# Altium project Shuttler_AMC.PrjPcb (part 16 of 20)

## Sheet FPGA_Banks_44_45_46_DDR64.SchDoc: =ProjectName
size 420 x 297 mm; Author: T.P.; CompanyName: WUT; DrawnBy: T.P.; Organization: WUT ISE; Address1: Warsaw Univeristy of Technology; Address2: Nowowiejska 15/19; DocumentNumber: 5; Revision: 0.9; SheetNumber: 5; SheetTotal: 36; EDA_Number: ARTIQ; Projet: ARTIQ/SINARA; ModifiedBy: -; CreateDate: XX/XX/XXXX; CheckedDate: -; Title2: FPGA_Banks_44_45_46_DDR64.SchDoc; DivGrp: ISE; Designer: G.K. and T.P.; ModifiedDate: -; ProjectName: ADC/DAC MEZZANINE
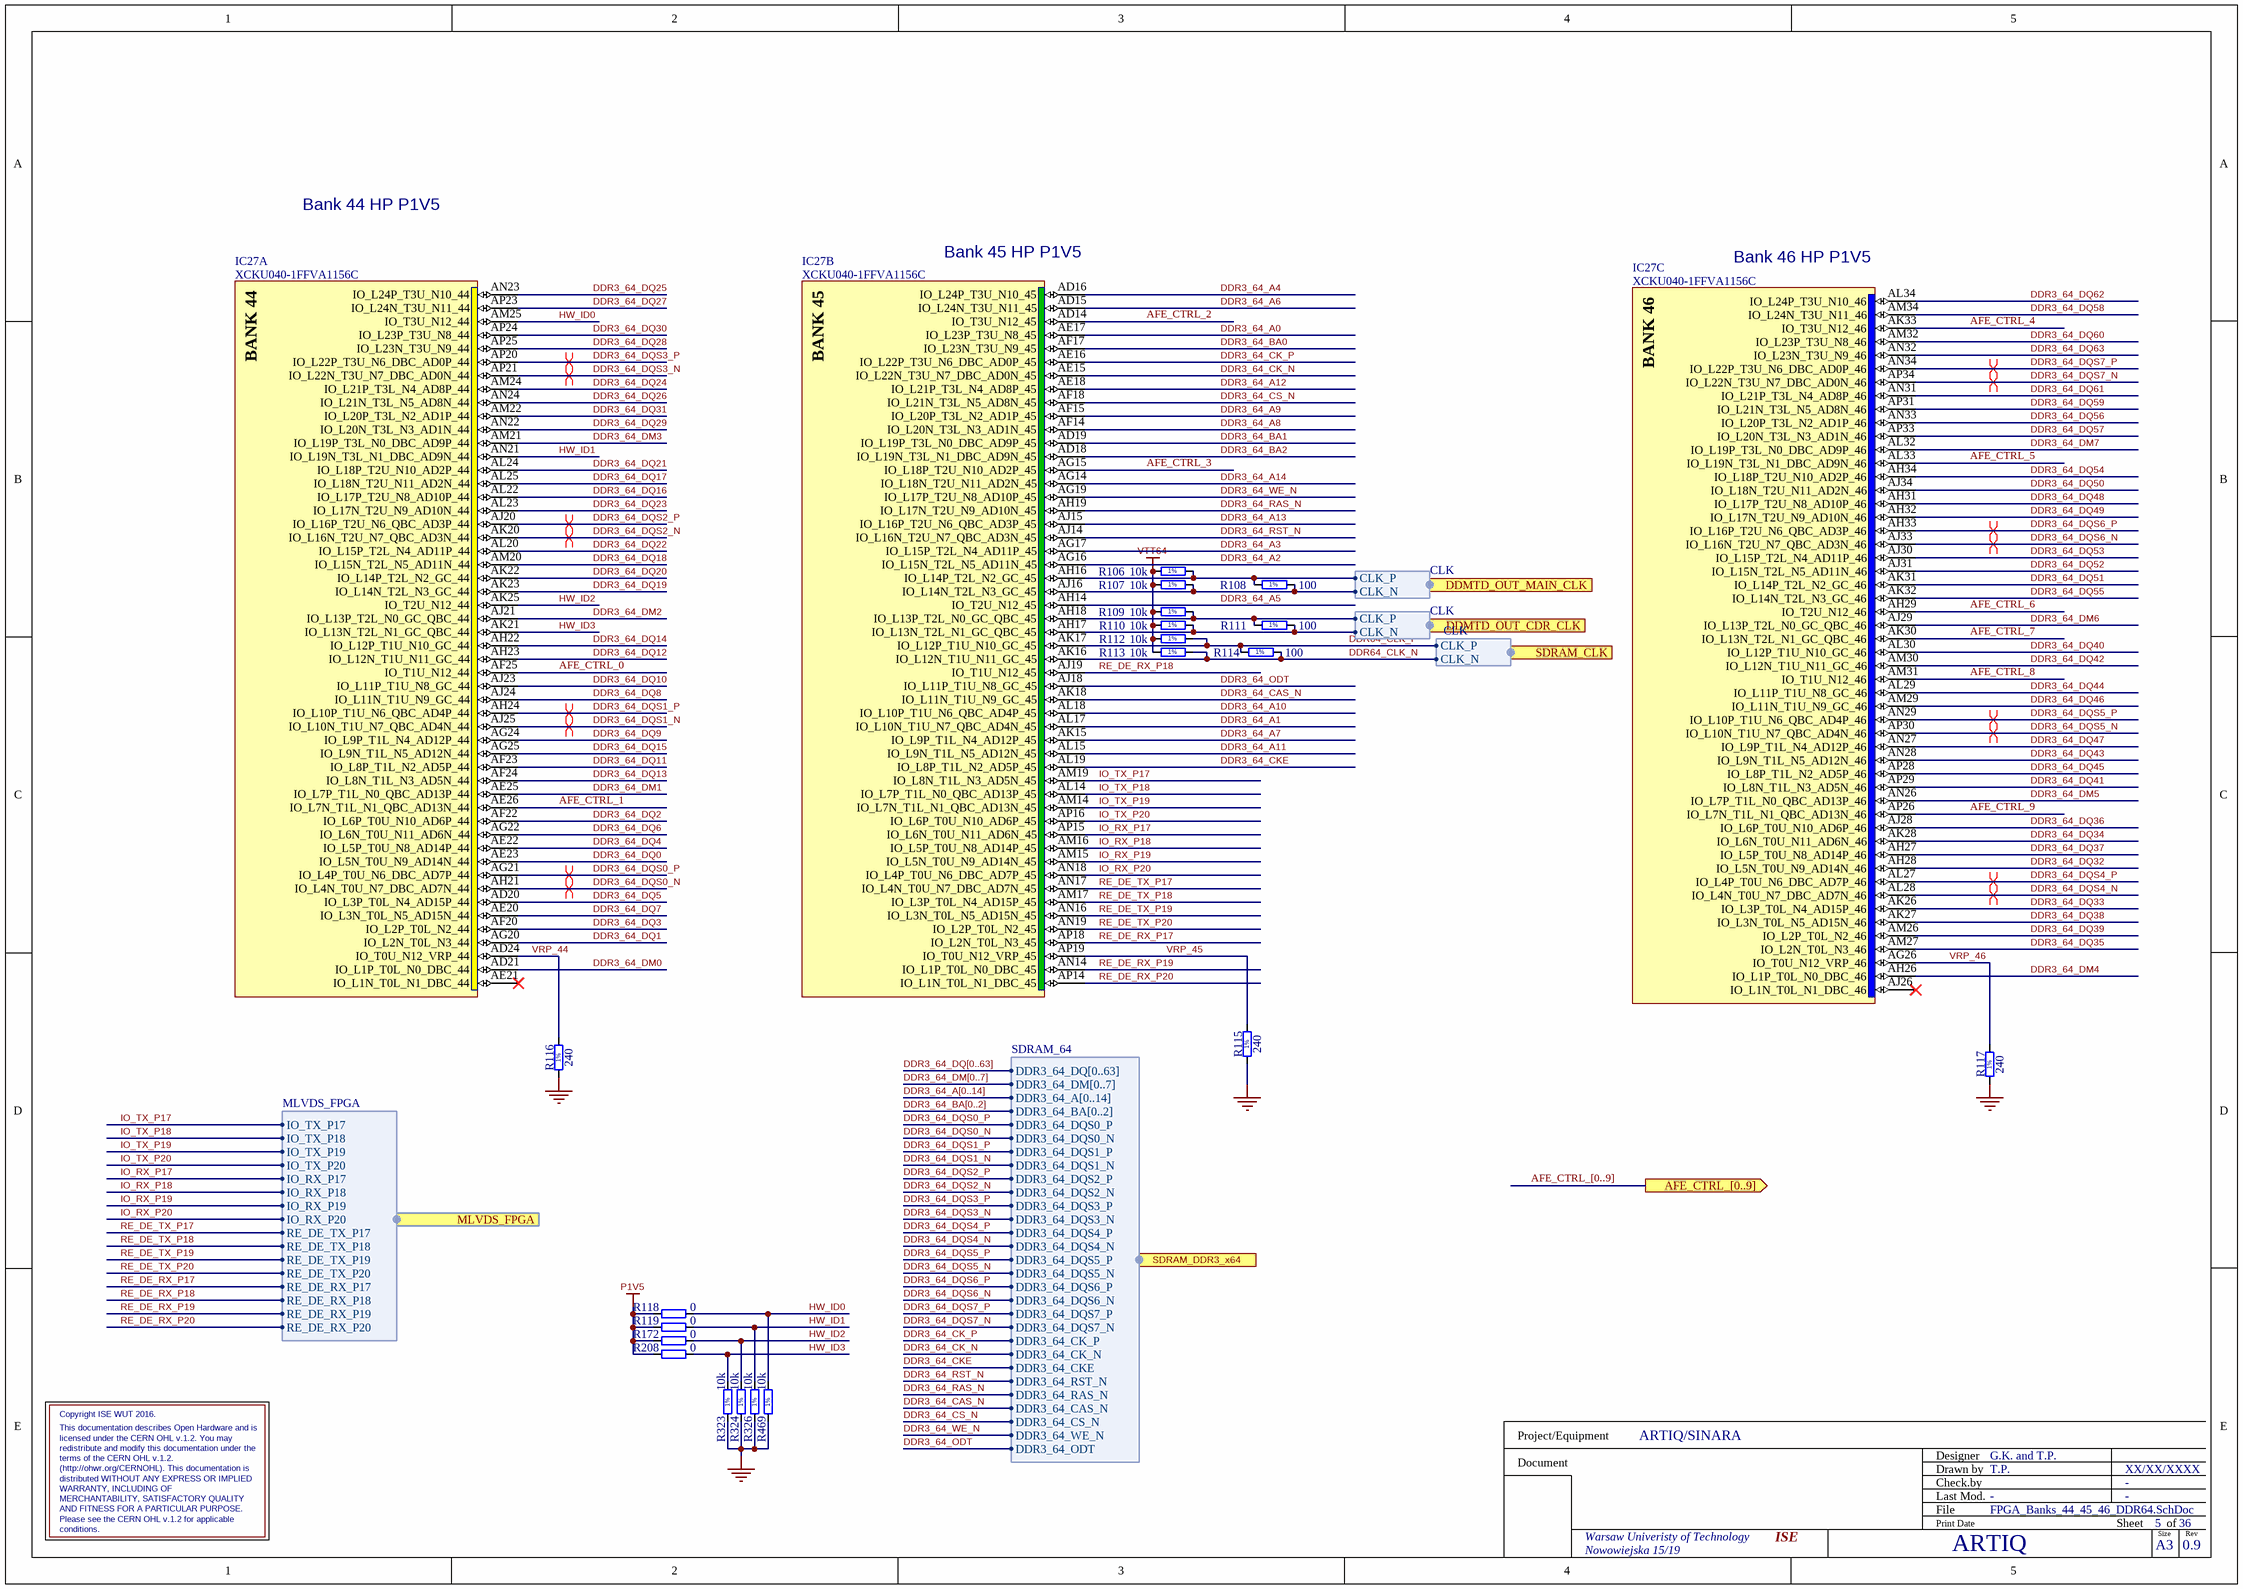
[diagram p29: FPGA_Banks_44_45_46_DDR64.SchDoc]

### Parts
IC27  XCKU040-1FFVA1156C  [BGA1156C100P34X34_3500X3500X350]  (parts A,B,C of 22)
R106  10k  [RESC1005X40N]
R107  10k  [RESC1005X40N]
R108  100  [RESC0603X28N]
R109  10k  [RESC1005X40N]
R110  10k  [RESC1005X40N]
R111  100  [RESC0603X28N]
R112  10k  [RESC1005X40N]
R113  10k  [RESC1005X40N]
R114  100  [RESC0603X28N]
R115  240  [RESC1005X40N]
R116  240  [RESC1005X40N]
R117  240  [RESC1005X40N]
R118  0  [RESC1005X40N]
R119  0  [RESC1005X40N]
R172  0  [RESC1005X40N]
R208  0  [RESC1005X40N]
R323  10k  [RESC1005X40N]
R324  10k  [RESC1005X40N]
R326  10k  [RESC1005X40N]
R469  10k  [RESC1005X40N]

### Ports
AFE_CTRL_[0..9] (out), DDMTD_OUT_CDR_CLK (harness CLK), DDMTD_OUT_MAIN_CLK (harness CLK), MLVDS_FPGA (harness MLVDS_FPGA), SDRAM_CLK (harness CLK), SDRAM_DDR3_x64 (harness SDRAM_64)

### Harnesses
SDRAM_64: DDR3_64_DQ[0..63], DDR3_64_DM[0..7], DDR3_64_A[0..14], DDR3_64_BA[0..2], DDR3_64_DQS1_P, DDR3_64_DQS0_N, DDR3_64_DQS0_P, DDR3_64_DQS5_P, DDR3_64_DQS5_N, DDR3_64_DQS6_P, DDR3_64_DQS6_N, DDR3_64_DQS7_P, DDR3_64_DQS7_N, DDR3_64_CK_P, DDR3_64_CK_N, DDR3_64_CKE, DDR3_64_RST_N, DDR3_64_RAS_N, DDR3_64_CAS_N, DDR3_64_WE_N, DDR3_64_CS_N, DDR3_64_DQS2_N, DDR3_64_DQS2_P, DDR3_64_DQS1_N, DDR3_64_DQS3_P, DDR3_64_ODT, DDR3_64_DQS4_P, DDR3_64_DQS3_N, DDR3_64_DQS4_N
MLVDS_FPGA: IO_TX_P17, IO_TX_P18, IO_TX_P19, IO_TX_P20, IO_RX_P17, IO_RX_P18, IO_RX_P19, IO_RX_P20, RE_DE_TX_P17, RE_DE_TX_P18, RE_DE_TX_P19, RE_DE_TX_P20, RE_DE_RX_P17, RE_DE_RX_P18, RE_DE_RX_P19, RE_DE_RX_P20
CLK: CLK_N, CLK_P

### Nets
GND: R115.1 R116.1 R117.1 R323.1 R324.1 R326.1 R469.1
P1V5: R118.1 R119.1 R172.1 R208.1
VTT64: R106.1 R107.1 R109.1 R110.1 R112.1 R113.1
AFE_CTRL_0: IC27.AF25(IO_T1U_N12_44)
AFE_CTRL_1: IC27.AE26(IO_L7N_T1L_N1_QBC_AD13N_44)
AFE_CTRL_2: IC27.AD14(IO_T3U_N12_45)
AFE_CTRL_3: IC27.AG15(IO_L18P_T2U_N10_AD2P_45)
AFE_CTRL_4: IC27.AK33(IO_T3U_N12_46)
AFE_CTRL_5: IC27.AL33(IO_L19N_T3L_N1_DBC_AD9N_46)
AFE_CTRL_6: IC27.AH29(IO_T2U_N12_46)
AFE_CTRL_7: IC27.AK30(IO_L13N_T2L_N1_GC_QBC_46)
AFE_CTRL_8: IC27.AM31(IO_T1U_N12_46)
AFE_CTRL_9: IC27.AP26(IO_L7N_T1L_N1_QBC_AD13N_46)
DDR3_64_A0: IC27.AE17(IO_L23P_T3U_N8_45)
DDR3_64_A1: IC27.AL17(IO_L10N_T1U_N7_QBC_AD4N_45)
DDR3_64_A2: IC27.AG16(IO_L15N_T2L_N5_AD11N_45)
DDR3_64_A3: IC27.AG17(IO_L15P_T2L_N4_AD11P_45)
DDR3_64_A4: IC27.AD16(IO_L24P_T3U_N10_45)
DDR3_64_A5: IC27.AH14(IO_T2U_N12_45)
DDR3_64_A6: IC27.AD15(IO_L24N_T3U_N11_45)
DDR3_64_A7: IC27.AK15(IO_L9P_T1L_N4_AD12P_45)
DDR3_64_A8: IC27.AF14(IO_L20N_T3L_N3_AD1N_45)
DDR3_64_A9: IC27.AF15(IO_L20P_T3L_N2_AD1P_45)
DDR3_64_A10: IC27.AL18(IO_L10P_T1U_N6_QBC_AD4P_45)
DDR3_64_A11: IC27.AL15(IO_L9N_T1L_N5_AD12N_45)
DDR3_64_A12: IC27.AE18(IO_L21P_T3L_N4_AD8P_45)
DDR3_64_A13: IC27.AJ15(IO_L16P_T2U_N6_QBC_AD3P_45)
DDR3_64_A14: IC27.AG14(IO_L18N_T2U_N11_AD2N_45)
DDR3_64_BA0: IC27.AF17(IO_L23N_T3U_N9_45)
DDR3_64_BA1: IC27.AD19(IO_L19P_T3L_N0_DBC_AD9P_45)
DDR3_64_BA2: IC27.AD18(IO_L19N_T3L_N1_DBC_AD9N_45)
DDR3_64_CAS_N: IC27.AK18(IO_L11N_T1U_N9_GC_45) ; port SDRAM_DDR3_x64.DDR3_64_CAS_N  [project net SDRAM_DDR3_x64.DDR3_64_CAS_N]
DDR3_64_CK_N: IC27.AE15(IO_L22N_T3U_N7_DBC_AD0N_45) ; port SDRAM_DDR3_x64.DDR3_64_CK_N  [project net SDRAM_DDR3_x64.DDR3_64_CK_N]
DDR3_64_CK_P: IC27.AE16(IO_L22P_T3U_N6_DBC_AD0P_45) ; port SDRAM_DDR3_x64.DDR3_64_CK_P  [project net SDRAM_DDR3_x64.DDR3_64_CK_P]
DDR3_64_CKE: IC27.AL19(IO_L8P_T1L_N2_AD5P_45) ; port SDRAM_DDR3_x64.DDR3_64_CKE  [project net SDRAM_DDR3_x64.DDR3_64_CKE]
DDR3_64_CS_N: IC27.AF18(IO_L21N_T3L_N5_AD8N_45) ; port SDRAM_DDR3_x64.DDR3_64_CS_N  [project net SDRAM_DDR3_x64.DDR3_64_CS_N]
DDR3_64_DM0: IC27.AD21(IO_L1P_T0L_N0_DBC_44)
DDR3_64_DM1: IC27.AE25(IO_L7P_T1L_N0_QBC_AD13P_44)
DDR3_64_DM2: IC27.AJ21(IO_L13P_T2L_N0_GC_QBC_44)
DDR3_64_DM3: IC27.AM21(IO_L19P_T3L_N0_DBC_AD9P_44)
DDR3_64_DM4: IC27.AH26(IO_L1P_T0L_N0_DBC_46)
DDR3_64_DM5: IC27.AN26(IO_L7P_T1L_N0_QBC_AD13P_46)
DDR3_64_DM6: IC27.AJ29(IO_L13P_T2L_N0_GC_QBC_46)
DDR3_64_DM7: IC27.AL32(IO_L19P_T3L_N0_DBC_AD9P_46)
DDR3_64_DQ0: IC27.AE23(IO_L5N_T0U_N9_AD14N_44)
DDR3_64_DQ1: IC27.AG20(IO_L2N_T0L_N3_44)
DDR3_64_DQ2: IC27.AF22(IO_L6P_T0U_N10_AD6P_44)
DDR3_64_DQ3: IC27.AF20(IO_L2P_T0L_N2_44)
DDR3_64_DQ4: IC27.AE22(IO_L5P_T0U_N8_AD14P_44)
DDR3_64_DQ5: IC27.AD20(IO_L3P_T0L_N4_AD15P_44)
DDR3_64_DQ6: IC27.AG22(IO_L6N_T0U_N11_AD6N_44)
DDR3_64_DQ7: IC27.AE20(IO_L3N_T0L_N5_AD15N_44)
DDR3_64_DQ8: IC27.AJ24(IO_L11N_T1U_N9_GC_44)
DDR3_64_DQ9: IC27.AG24(IO_L9P_T1L_N4_AD12P_44)
DDR3_64_DQ10: IC27.AJ23(IO_L11P_T1U_N8_GC_44)
DDR3_64_DQ11: IC27.AF23(IO_L8P_T1L_N2_AD5P_44)
DDR3_64_DQ12: IC27.AH23(IO_L12N_T1U_N11_GC_44)
DDR3_64_DQ13: IC27.AF24(IO_L8N_T1L_N3_AD5N_44)
DDR3_64_DQ14: IC27.AH22(IO_L12P_T1U_N10_GC_44)
DDR3_64_DQ15: IC27.AG25(IO_L9N_T1L_N5_AD12N_44)
DDR3_64_DQ16: IC27.AL22(IO_L17P_T2U_N8_AD10P_44)
DDR3_64_DQ17: IC27.AL25(IO_L18N_T2U_N11_AD2N_44)
DDR3_64_DQ18: IC27.AM20(IO_L15N_T2L_N5_AD11N_44)
DDR3_64_DQ19: IC27.AK23(IO_L14N_T2L_N3_GC_44)
DDR3_64_DQ20: IC27.AK22(IO_L14P_T2L_N2_GC_44)
DDR3_64_DQ21: IC27.AL24(IO_L18P_T2U_N10_AD2P_44)
DDR3_64_DQ22: IC27.AL20(IO_L15P_T2L_N4_AD11P_44)
DDR3_64_DQ23: IC27.AL23(IO_L17N_T2U_N9_AD10N_44)
DDR3_64_DQ24: IC27.AM24(IO_L21P_T3L_N4_AD8P_44)
DDR3_64_DQ25: IC27.AN23(IO_L24P_T3U_N10_44)
DDR3_64_DQ26: IC27.AN24(IO_L21N_T3L_N5_AD8N_44)
DDR3_64_DQ27: IC27.AP23(IO_L24N_T3U_N11_44)
DDR3_64_DQ28: IC27.AP25(IO_L23N_T3U_N9_44)
DDR3_64_DQ29: IC27.AN22(IO_L20N_T3L_N3_AD1N_44)
DDR3_64_DQ30: IC27.AP24(IO_L23P_T3U_N8_44)
DDR3_64_DQ31: IC27.AM22(IO_L20P_T3L_N2_AD1P_44)
DDR3_64_DQ32: IC27.AH28(IO_L5N_T0U_N9_AD14N_46)
DDR3_64_DQ33: IC27.AK26(IO_L3P_T0L_N4_AD15P_46)
DDR3_64_DQ34: IC27.AK28(IO_L6N_T0U_N11_AD6N_46)
DDR3_64_DQ35: IC27.AM27(IO_L2N_T0L_N3_46)
DDR3_64_DQ36: IC27.AJ28(IO_L6P_T0U_N10_AD6P_46)
DDR3_64_DQ37: IC27.AH27(IO_L5P_T0U_N8_AD14P_46)
DDR3_64_DQ38: IC27.AK27(IO_L3N_T0L_N5_AD15N_46)
DDR3_64_DQ39: IC27.AM26(IO_L2P_T0L_N2_46)
DDR3_64_DQ40: IC27.AL30(IO_L12P_T1U_N10_GC_46)
DDR3_64_DQ41: IC27.AP29(IO_L8N_T1L_N3_AD5N_46)
DDR3_64_DQ42: IC27.AM30(IO_L12N_T1U_N11_GC_46)
DDR3_64_DQ43: IC27.AN28(IO_L9N_T1L_N5_AD12N_46)
DDR3_64_DQ44: IC27.AL29(IO_L11P_T1U_N8_GC_46)
DDR3_64_DQ45: IC27.AP28(IO_L8P_T1L_N2_AD5P_46)
DDR3_64_DQ46: IC27.AM29(IO_L11N_T1U_N9_GC_46)
DDR3_64_DQ47: IC27.AN27(IO_L9P_T1L_N4_AD12P_46)
DDR3_64_DQ48: IC27.AH31(IO_L17P_T2U_N8_AD10P_46)
DDR3_64_DQ49: IC27.AH32(IO_L17N_T2U_N9_AD10N_46)
DDR3_64_DQ50: IC27.AJ34(IO_L18N_T2U_N11_AD2N_46)
DDR3_64_DQ51: IC27.AK31(IO_L14P_T2L_N2_GC_46)
DDR3_64_DQ52: IC27.AJ31(IO_L15N_T2L_N5_AD11N_46)
DDR3_64_DQ53: IC27.AJ30(IO_L15P_T2L_N4_AD11P_46)
DDR3_64_DQ54: IC27.AH34(IO_L18P_T2U_N10_AD2P_46)
DDR3_64_DQ55: IC27.AK32(IO_L14N_T2L_N3_GC_46)
DDR3_64_DQ56: IC27.AN33(IO_L20P_T3L_N2_AD1P_46)
DDR3_64_DQ57: IC27.AP33(IO_L20N_T3L_N3_AD1N_46)
DDR3_64_DQ58: IC27.AM34(IO_L24N_T3U_N11_46)
DDR3_64_DQ59: IC27.AP31(IO_L21N_T3L_N5_AD8N_46)
DDR3_64_DQ60: IC27.AM32(IO_L23P_T3U_N8_46)
DDR3_64_DQ61: IC27.AN31(IO_L21P_T3L_N4_AD8P_46)
DDR3_64_DQ62: IC27.AL34(IO_L24P_T3U_N10_46)
DDR3_64_DQ63: IC27.AN32(IO_L23N_T3U_N9_46)
DDR3_64_DQS0_N: IC27.AH21(IO_L4N_T0U_N7_DBC_AD7N_44) ; port SDRAM_DDR3_x64.DDR3_64_DQS0_N  [project net SDRAM_DDR3_x64.DDR3_64_DQS0_N]
DDR3_64_DQS0_P: IC27.AG21(IO_L4P_T0U_N6_DBC_AD7P_44) ; port SDRAM_DDR3_x64.DDR3_64_DQS0_P  [project net SDRAM_DDR3_x64.DDR3_64_DQS0_P]
DDR3_64_DQS1_N: IC27.AJ25(IO_L10N_T1U_N7_QBC_AD4N_44) ; port SDRAM_DDR3_x64.DDR3_64_DQS1_N  [project net SDRAM_DDR3_x64.DDR3_64_DQS1_N]
DDR3_64_DQS1_P: IC27.AH24(IO_L10P_T1U_N6_QBC_AD4P_44) ; port SDRAM_DDR3_x64.DDR3_64_DQS1_P  [project net SDRAM_DDR3_x64.DDR3_64_DQS1_P]
DDR3_64_DQS2_N: IC27.AK20(IO_L16N_T2U_N7_QBC_AD3N_44) ; port SDRAM_DDR3_x64.DDR3_64_DQS2_N  [project net SDRAM_DDR3_x64.DDR3_64_DQS2_N]
DDR3_64_DQS2_P: IC27.AJ20(IO_L16P_T2U_N6_QBC_AD3P_44) ; port SDRAM_DDR3_x64.DDR3_64_DQS2_P  [project net SDRAM_DDR3_x64.DDR3_64_DQS2_P]
DDR3_64_DQS3_N: IC27.AP21(IO_L22N_T3U_N7_DBC_AD0N_44) ; port SDRAM_DDR3_x64.DDR3_64_DQS3_N  [project net SDRAM_DDR3_x64.DDR3_64_DQS3_N]
DDR3_64_DQS3_P: IC27.AP20(IO_L22P_T3U_N6_DBC_AD0P_44) ; port SDRAM_DDR3_x64.DDR3_64_DQS3_P  [project net SDRAM_DDR3_x64.DDR3_64_DQS3_P]
DDR3_64_DQS4_N: IC27.AL28(IO_L4N_T0U_N7_DBC_AD7N_46) ; port SDRAM_DDR3_x64.DDR3_64_DQS4_N  [project net SDRAM_DDR3_x64.DDR3_64_DQS4_N]
DDR3_64_DQS4_P: IC27.AL27(IO_L4P_T0U_N6_DBC_AD7P_46) ; port SDRAM_DDR3_x64.DDR3_64_DQS4_P  [project net SDRAM_DDR3_x64.DDR3_64_DQS4_P]
DDR3_64_DQS5_N: IC27.AP30(IO_L10N_T1U_N7_QBC_AD4N_46) ; port SDRAM_DDR3_x64.DDR3_64_DQS5_N  [project net SDRAM_DDR3_x64.DDR3_64_DQS5_N]
DDR3_64_DQS5_P: IC27.AN29(IO_L10P_T1U_N6_QBC_AD4P_46) ; port SDRAM_DDR3_x64.DDR3_64_DQS5_P  [project net SDRAM_DDR3_x64.DDR3_64_DQS5_P]
DDR3_64_DQS6_N: IC27.AJ33(IO_L16N_T2U_N7_QBC_AD3N_46) ; port SDRAM_DDR3_x64.DDR3_64_DQS6_N  [project net SDRAM_DDR3_x64.DDR3_64_DQS6_N]
DDR3_64_DQS6_P: IC27.AH33(IO_L16P_T2U_N6_QBC_AD3P_46) ; port SDRAM_DDR3_x64.DDR3_64_DQS6_P  [project net SDRAM_DDR3_x64.DDR3_64_DQS6_P]
DDR3_64_DQS7_N: IC27.AP34(IO_L22N_T3U_N7_DBC_AD0N_46) ; port SDRAM_DDR3_x64.DDR3_64_DQS7_N  [project net SDRAM_DDR3_x64.DDR3_64_DQS7_N]
DDR3_64_DQS7_P: IC27.AN34(IO_L22P_T3U_N6_DBC_AD0P_46) ; port SDRAM_DDR3_x64.DDR3_64_DQS7_P  [project net SDRAM_DDR3_x64.DDR3_64_DQS7_P]
DDR3_64_ODT: IC27.AJ18(IO_L11P_T1U_N8_GC_45) ; port SDRAM_DDR3_x64.DDR3_64_ODT  [project net SDRAM_DDR3_x64.DDR3_64_ODT]
DDR3_64_RAS_N: IC27.AH19(IO_L17N_T2U_N9_AD10N_45) ; port SDRAM_DDR3_x64.DDR3_64_RAS_N  [project net SDRAM_DDR3_x64.DDR3_64_RAS_N]
DDR3_64_RST_N: IC27.AJ14(IO_L16N_T2U_N7_QBC_AD3N_45) ; port SDRAM_DDR3_x64.DDR3_64_RST_N  [project net SDRAM_DDR3_x64.DDR3_64_RST_N]
DDR3_64_WE_N: IC27.AG19(IO_L17P_T2U_N8_AD10P_45) ; port SDRAM_DDR3_x64.DDR3_64_WE_N  [project net SDRAM_DDR3_x64.DDR3_64_WE_N]
DDR64_CLK_N: IC27.AK16(IO_L12N_T1U_N11_GC_45) R113.2 R114.2 ; port SDRAM_CLK.CLK_N
DDR64_CLK_P: IC27.AK17(IO_L12P_T1U_N10_GC_45) R112.2 R114.1 ; port SDRAM_CLK.CLK_P
HW_ID0: IC27.AM25(IO_T3U_N12_44) R118.2 R469.2
HW_ID1: IC27.AN21(IO_L19N_T3L_N1_DBC_AD9N_44) R119.2 R326.2
HW_ID2: IC27.AK25(IO_T2U_N12_44) R172.2 R324.2
HW_ID3: IC27.AK21(IO_L13N_T2L_N1_GC_QBC_44) R208.2 R323.2
IO_RX_P17: IC27.AP15(IO_L6N_T0U_N11_AD6N_45) ; port MLVDS_FPGA.IO_RX_P17
IO_RX_P18: IC27.AM16(IO_L5P_T0U_N8_AD14P_45) ; port MLVDS_FPGA.IO_RX_P18
IO_RX_P19: IC27.AM15(IO_L5N_T0U_N9_AD14N_45) ; port MLVDS_FPGA.IO_RX_P19
IO_RX_P20: IC27.AN18(IO_L4P_T0U_N6_DBC_AD7P_45) ; port MLVDS_FPGA.IO_RX_P20
IO_TX_P17: IC27.AM19(IO_L8N_T1L_N3_AD5N_45) ; port MLVDS_FPGA.IO_TX_P17
IO_TX_P18: IC27.AL14(IO_L7P_T1L_N0_QBC_AD13P_45) ; port MLVDS_FPGA.IO_TX_P18
IO_TX_P19: IC27.AM14(IO_L7N_T1L_N1_QBC_AD13N_45) ; port MLVDS_FPGA.IO_TX_P19
IO_TX_P20: IC27.AP16(IO_L6P_T0U_N10_AD6P_45) ; port MLVDS_FPGA.IO_TX_P20
RE_DE_RX_P17: IC27.AP18(IO_L2N_T0L_N3_45) ; port MLVDS_FPGA.RE_DE_RX_P17
RE_DE_RX_P18: IC27.AJ19(IO_T1U_N12_45) ; port MLVDS_FPGA.RE_DE_RX_P18
RE_DE_RX_P19: IC27.AN14(IO_L1P_T0L_N0_DBC_45) ; port MLVDS_FPGA.RE_DE_RX_P19
RE_DE_RX_P20: IC27.AP14(IO_L1N_T0L_N1_DBC_45) ; port MLVDS_FPGA.RE_DE_RX_P20
RE_DE_TX_P17: IC27.AN17(IO_L4N_T0U_N7_DBC_AD7N_45) ; port MLVDS_FPGA.RE_DE_TX_P17
RE_DE_TX_P18: IC27.AM17(IO_L3P_T0L_N4_AD15P_45) ; port MLVDS_FPGA.RE_DE_TX_P18
RE_DE_TX_P19: IC27.AN16(IO_L3N_T0L_N5_AD15N_45) ; port MLVDS_FPGA.RE_DE_TX_P19
RE_DE_TX_P20: IC27.AN19(IO_L2P_T0L_N2_45) ; port MLVDS_FPGA.RE_DE_TX_P20
VRP_44: IC27.AD24(IO_T0U_N12_VRP_44) R116.2
VRP_45: IC27.AP19(IO_T0U_N12_VRP_45) R115.2
VRP_46: IC27.AG26(IO_T0U_N12_VRP_46) R117.2
NetIC27_AH16: IC27.AH16(IO_L14P_T2L_N2_GC_45) R106.2 R108.1 ; port DDMTD_OUT_MAIN_CLK.CLK_P
NetIC27_AH17: IC27.AH17(IO_L13N_T2L_N1_GC_QBC_45) R110.2 R111.2 ; port DDMTD_OUT_CDR_CLK.CLK_N
NetIC27_AH18: IC27.AH18(IO_L13P_T2L_N0_GC_QBC_45) R109.2 R111.1 ; port DDMTD_OUT_CDR_CLK.CLK_P
NetIC27_AJ16: IC27.AJ16(IO_L14N_T2L_N3_GC_45) R107.2 R108.2 ; port DDMTD_OUT_MAIN_CLK.CLK_N

Not connected (* = marked no-connect by the designer): IC27 AE21(IO_L1N_T0L_N1_DBC_44)* AJ26(IO_L1N_T0L_N1_DBC_46)*

### Buses and harness runs
bus AFE_CTRL_[0..9] = port AFE_CTRL_[0..9]
bus DDR3_64_A[0..14]
bus DDR3_64_BA[0..2]
bus DDR3_64_DM[0..7]
bus DDR3_64_DQ[0..63]

### Layout directives
differential pair: SDRAM_DDR3_x64.DDR3_64_DQS0_N, SDRAM_DDR3_x64.DDR3_64_DQS0_P, SDRAM_DDR3_x64.DDR3_64_DQS1_N, SDRAM_DDR3_x64.DDR3_64_DQS1_P, SDRAM_DDR3_x64.DDR3_64_DQS2_N, SDRAM_DDR3_x64.DDR3_64_DQS2_P, SDRAM_DDR3_x64.DDR3_64_DQS3_N, SDRAM_DDR3_x64.DDR3_64_DQS3_P, SDRAM_DDR3_x64.DDR3_64_DQS4_N, SDRAM_DDR3_x64.DDR3_64_DQS4_P, SDRAM_DDR3_x64.DDR3_64_DQS5_N, SDRAM_DDR3_x64.DDR3_64_DQS5_P, SDRAM_DDR3_x64.DDR3_64_DQS6_N, SDRAM_DDR3_x64.DDR3_64_DQS6_P, SDRAM_DDR3_x64.DDR3_64_DQS7_N, SDRAM_DDR3_x64.DDR3_64_DQS7_P

### Notes on the sheet
- Bank 44 HP P1V5
- (near IC27) Bank 45 HP P1V5
- (near IC27) Bank 46 HP P1V5
- Copyright ISE WUT 2016.
- WARRANTY, INCLUDING OF
- licensed under the CERN OHL v.1.2. You may
- This documentation describes Open Hardware and is
- distributed WITHOUT ANY EXPRESS OR IMPLIED
- (http://ohwr.org/CERNOHL). This documentation is
- terms of the CERN OHL v.1.2.
- redistribute and modify this documentation under the
- AND FITNESS FOR A PARTICULAR PURPOSE.
- Please see the CERN OHL v.1.2 for applicable
- MERCHANTABILITY, SATISFACTORY QUALITY
- conditions.
- Project/Equipment
- Document
- Designer
- Drawn by
- Check.by
- File
- Last Mod.
- Print Date
- Sheet
- Size
- A3
- of
- Rev
- (in symbol R0201_100R_1%_0.05W_200PPM) 1%
- (in symbol R0402_10K_1%_0.0625W_100PPM) 1%
- (in symbol R0402_240R_1%_0.0625W_100PPM) 1%
- (in symbol XCKU040-1FFVA1156C, part A) BANK 44
- (in symbol XCKU040-1FFVA1156C, part B) BANK 45
- (in symbol XCKU040-1FFVA1156C, part C) BANK 46

### Library data of the parts
IC27 = XCKU040-1FFVA1156C: as IC27 on sheet FPGA_Bank_0_CFG; Manufacturer Part Number: XCKU040-1FFVA1156C; PackageDescription: BGA, 1.00mm Pitch, Square; 1156 Pin, 34 Columns X 34 Rows, Body 35.00mm X 35.00mm X 3.50mm H, IPC Medium Density; Part Number: XCKU040-1FFVA1156C; Component Kind: Standard; Component Type: Standard; Device: XCKU040-1FFVA1156C; Pin Count: 1156; Case: BGA1156; Mounted: Yes; Socket: No; SMD: Yes; Sense: No; ComponentHeight: 3.5mm; HelpURL: \\cern.ch\dfs\Applications\Altium\Datasheets\XCKU040-1FFVA1156C.pdf; ComponentLink1URL: \\cern.ch\dfs\Applications\Altium\Datasheets\XCKU040-1FFVA1156C_Package-Pinout.pdf; ComponentLink1Description: Package/Pinout; Author: CERN DEM CA; CreateDate: 16.08.2016; LatestRevisionDate: 16.08.2016
R106 R107 R109 R110 R112 R113 = R0402_10K_1%_0.0625W_100PPM: Resistor - 1%; Part Description: General Purpose Thick Film Chip Resistor; Manufacturer: GENERIC; Manufacturer1 Part Number: 232270671003L; TC: ±100ppm/°C; PressFit: No; Part Number: R0402_10K_1%_0.0625W_100PPM; Tolerance: ±1%; Value: 10k; Component Kind: Standard; Component Type: Standard; Pin Count: 2; Status: Not Recommended; Power: 0.0625W; Manufacturer Part Number: R0402_10K_1%_0.0625W_100PPM; Case: 0402; Mounted: Yes; Sense: No; Socket: No; SMD: Yes; Manufacturer1 Example: YAGEO PHYCOMP; Manufacturer1 ComponentHeight: 0.4mm; HelpURL: \\cern.ch\dfs\Applications\Altium\Datasheets\R0402_Phycomp_RC0402.pdf; Author: CERN DEM JLC; CreateDate: 03.12.2007; LatestRevisionDate: 17.10.2012
R108 R111 R114 = R0201_100R_1%_0.05W_200PPM: as R380 on sheet FPGA_Bank_0_CFG; Manufacturer Part Number: R0201_100R_1%_0.05W_200PPM; Part Number: R0201_100R_1%_0.05W_200PPM; Tolerance: ±1%; Value: 100; Component Kind: Standard; Component Type: Standard; Pin Count: 2; Status: Not Recommended; Case: 0201; Mounted: Yes; Sense: No; Socket: No; SMD: Yes; Manufacturer1 Example: VISHAY; Manufacturer1 ComponentHeight: 0.27mm; HelpURL: \\cern.ch\dfs\Applications\Altium\Datasheets\R0201_VISHAY_CRCW e3.pdf; Author: CERN DEM JLC; CreateDate: 13.11.2014; LatestRevisionDate: 13.11.2014
R115-R117 = R0402_240R_1%_0.0625W_100PPM: Resistor - 1%; Manufacturer: GENERIC; Part Description: General Purpose Thick Film Chip Resistor; Manufacturer1 Part Number: 232270672401L; TC: ±100ppm/°C; PressFit: No; Manufacturer Part Number: R0402_240R_1%_0.0625W_100PPM; Part Number: R0402_240R_1%_0.0625W_100PPM; Tolerance: ±1%; Value: 240; Component Kind: Standard; Component Type: Standard; Pin Count: 2; Status: Not Recommended; Power: 0.0625W; Case: 0402; Mounted: Yes; Sense: No; Socket: No; SMD: Yes; Manufacturer1 Example: YAGEO PHYCOMP; Manufacturer1 ComponentHeight: 0.4mm; HelpURL: \\cern.ch\dfs\Applications\Altium\Datasheets\R0402_Phycomp_RC0402.pdf; Author: CERN DEM JLC; CreateDate: 03.12.2007; LatestRevisionDate: 17.10.2012
R118 R119 R172 R208 = R0402_0R_JUMPER: as R385 on sheet FPGA_Bank_0_CFG; Manufacturer Part Number: R0402_0R_JUMPER; Part Number: R0402_0R_JUMPER; Value: 0; Component Kind: Standard; Component Type: Standard; Pin Count: 2; Status: Not Recommended; Case: 0402; Mounted: Yes; Sense: No; Socket: No; SMD: Yes; Manufacturer1 Example: YAGEO PHYCOMP; Manufacturer1 ComponentHeight: 0.4mm; HelpURL: \\cern.ch\dfs\Applications\Altium\Datasheets\R0402_Phycomp_RC0402.pdf; Author: CERN DEM JLC; CreateDate: 03.12.2007; LatestRevisionDate: 17.10.2012
R323 R324 R326 R469 = R0402_10K_1%_0.0625W_100PPM: as R398 on sheet FPGA_Bank_0_CFG; Manufacturer Part Number: R0402_10K_1%_0.0625W_100PPM; Part Number: R0402_10K_1%_0.0625W_100PPM; Tolerance: ±1%; Value: 10k; Component Kind: Standard; Component Type: Standard; Pin Count: 2; Status: Not Recommended; Power: 0.0625W; Case: 0402; Mounted: Yes; Sense: No; Socket: No; SMD: Yes; Manufacturer1 Example: YAGEO PHYCOMP; Manufacturer1 ComponentHeight: 0.4mm; HelpURL: \\cern.ch\dfs\Applications\Altium\Datasheets\R0402_Phycomp_RC0402.pdf; Author: CERN DEM JLC; CreateDate: 03.12.2007; LatestRevisionDate: 17.10.2012

## Sheet FPGA_Banks_47_48_HP.SchDoc: =ProjectName
size 420 x 297 mm; Author: T.P.; CompanyName: WUT; DrawnBy: T.P.; Organization: WUT ISE; Address1: Warsaw Univeristy of Technology; Address2: Nowowiejska 15/19; DocumentNumber: 6; Revision: 0.9; SheetNumber: 6; SheetTotal: 36; EDA_Number: ARTIQ; Projet: ARTIQ/SINARA; ModifiedBy: -; CreateDate: XX/XX/XXXX; CheckedDate: -; Title2: FPGA_Banks_47_48_HP.SchDoc; DivGrp: ISE; Designer: G.K. and T.P.; ModifiedDate: -; ProjectName: ADC/DAC MEZZANINE
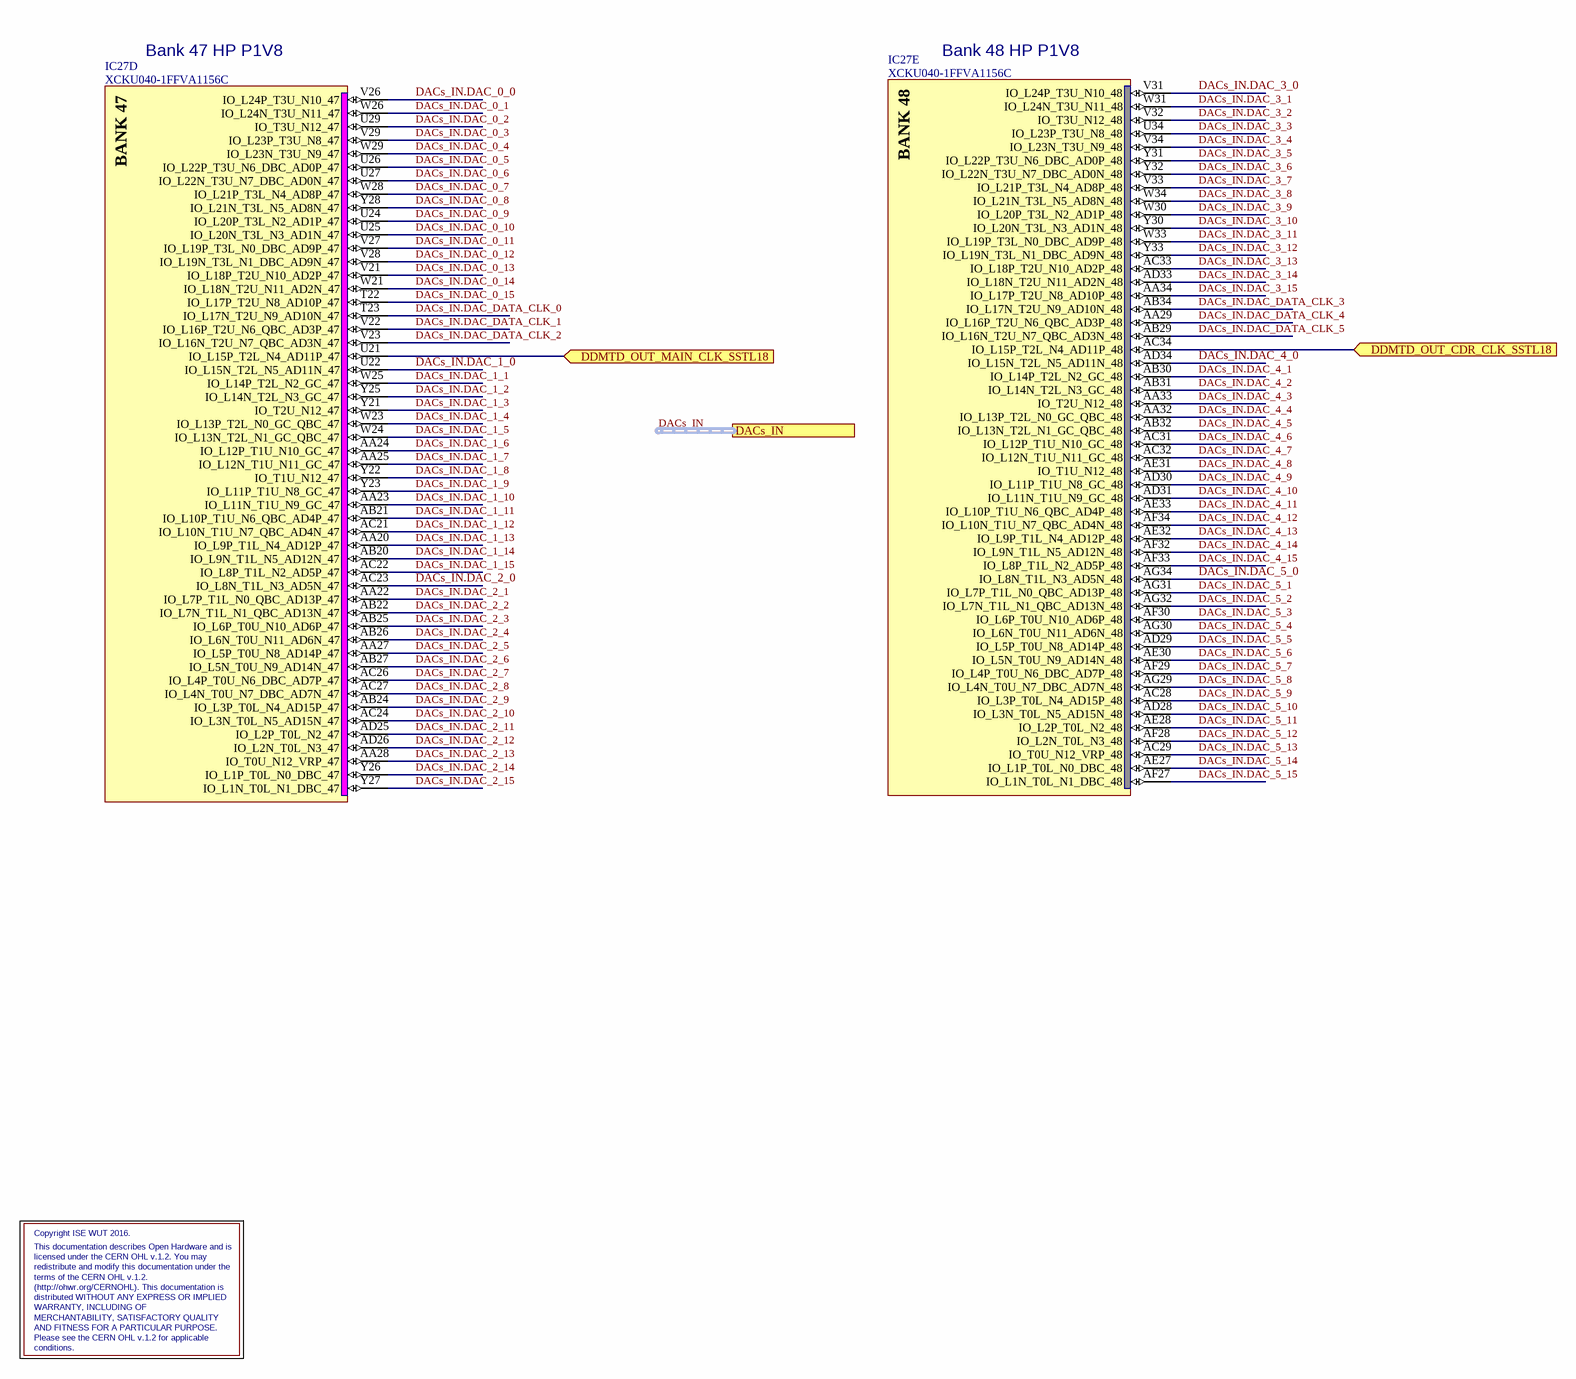
[diagram p30: FPGA_Banks_47_48_HP.SchDoc]

### Parts
IC27  XCKU040-1FFVA1156C  [BGA1156C100P34X34_3500X3500X350]  (parts D,E of 22)

### Ports
DACs_IN (harness DAC_IN), DDMTD_OUT_CDR_CLK_SSTL18 (in), DDMTD_OUT_MAIN_CLK_SSTL18 (in)

### Nets
DACs_IN.DAC_0_0: IC27.V26(IO_L24P_T3U_N10_47)
DACs_IN.DAC_0_1: IC27.W26(IO_L24N_T3U_N11_47)
DACs_IN.DAC_0_2: IC27.U29(IO_T3U_N12_47)
DACs_IN.DAC_0_3: IC27.V29(IO_L23P_T3U_N8_47)
DACs_IN.DAC_0_4: IC27.W29(IO_L23N_T3U_N9_47)
DACs_IN.DAC_0_5: IC27.U26(IO_L22P_T3U_N6_DBC_AD0P_47)
DACs_IN.DAC_0_6: IC27.U27(IO_L22N_T3U_N7_DBC_AD0N_47)
DACs_IN.DAC_0_7: IC27.W28(IO_L21P_T3L_N4_AD8P_47)
DACs_IN.DAC_0_8: IC27.Y28(IO_L21N_T3L_N5_AD8N_47)
DACs_IN.DAC_0_9: IC27.U24(IO_L20P_T3L_N2_AD1P_47)
DACs_IN.DAC_0_10: IC27.U25(IO_L20N_T3L_N3_AD1N_47)
DACs_IN.DAC_0_11: IC27.V27(IO_L19P_T3L_N0_DBC_AD9P_47)
DACs_IN.DAC_0_12: IC27.V28(IO_L19N_T3L_N1_DBC_AD9N_47)
DACs_IN.DAC_0_13: IC27.V21(IO_L18P_T2U_N10_AD2P_47)
DACs_IN.DAC_0_14: IC27.W21(IO_L18N_T2U_N11_AD2N_47)
DACs_IN.DAC_0_15: IC27.T22(IO_L17P_T2U_N8_AD10P_47)
DACs_IN.DAC_1_0: IC27.U22(IO_L15N_T2L_N5_AD11N_47)
DACs_IN.DAC_1_1: IC27.W25(IO_L14P_T2L_N2_GC_47)
DACs_IN.DAC_1_2: IC27.Y25(IO_L14N_T2L_N3_GC_47)
DACs_IN.DAC_1_3: IC27.Y21(IO_T2U_N12_47)
DACs_IN.DAC_1_4: IC27.W23(IO_L13P_T2L_N0_GC_QBC_47)
DACs_IN.DAC_1_5: IC27.W24(IO_L13N_T2L_N1_GC_QBC_47)
DACs_IN.DAC_1_6: IC27.AA24(IO_L12P_T1U_N10_GC_47)
DACs_IN.DAC_1_7: IC27.AA25(IO_L12N_T1U_N11_GC_47)
DACs_IN.DAC_1_8: IC27.Y22(IO_T1U_N12_47)
DACs_IN.DAC_1_9: IC27.Y23(IO_L11P_T1U_N8_GC_47)
DACs_IN.DAC_1_10: IC27.AA23(IO_L11N_T1U_N9_GC_47)
DACs_IN.DAC_1_11: IC27.AB21(IO_L10P_T1U_N6_QBC_AD4P_47)
DACs_IN.DAC_1_12: IC27.AC21(IO_L10N_T1U_N7_QBC_AD4N_47)
DACs_IN.DAC_1_13: IC27.AA20(IO_L9P_T1L_N4_AD12P_47)
DACs_IN.DAC_1_14: IC27.AB20(IO_L9N_T1L_N5_AD12N_47)
DACs_IN.DAC_1_15: IC27.AC22(IO_L8P_T1L_N2_AD5P_47)
DACs_IN.DAC_2_0: IC27.AC23(IO_L8N_T1L_N3_AD5N_47)
DACs_IN.DAC_2_1: IC27.AA22(IO_L7P_T1L_N0_QBC_AD13P_47)
DACs_IN.DAC_2_2: IC27.AB22(IO_L7N_T1L_N1_QBC_AD13N_47)
DACs_IN.DAC_2_3: IC27.AB25(IO_L6P_T0U_N10_AD6P_47)
DACs_IN.DAC_2_4: IC27.AB26(IO_L6N_T0U_N11_AD6N_47)
DACs_IN.DAC_2_5: IC27.AA27(IO_L5P_T0U_N8_AD14P_47)
DACs_IN.DAC_2_6: IC27.AB27(IO_L5N_T0U_N9_AD14N_47)
DACs_IN.DAC_2_7: IC27.AC26(IO_L4P_T0U_N6_DBC_AD7P_47)
DACs_IN.DAC_2_8: IC27.AC27(IO_L4N_T0U_N7_DBC_AD7N_47)
DACs_IN.DAC_2_9: IC27.AB24(IO_L3P_T0L_N4_AD15P_47)
DACs_IN.DAC_2_10: IC27.AC24(IO_L3N_T0L_N5_AD15N_47)
DACs_IN.DAC_2_11: IC27.AD25(IO_L2P_T0L_N2_47)
DACs_IN.DAC_2_12: IC27.AD26(IO_L2N_T0L_N3_47)
DACs_IN.DAC_2_13: IC27.AA28(IO_T0U_N12_VRP_47)
DACs_IN.DAC_2_14: IC27.Y26(IO_L1P_T0L_N0_DBC_47)
DACs_IN.DAC_2_15: IC27.Y27(IO_L1N_T0L_N1_DBC_47)
DACs_IN.DAC_3_0: IC27.V31(IO_L24P_T3U_N10_48)
DACs_IN.DAC_3_1: IC27.W31(IO_L24N_T3U_N11_48)
DACs_IN.DAC_3_2: IC27.V32(IO_T3U_N12_48)
DACs_IN.DAC_3_3: IC27.U34(IO_L23P_T3U_N8_48)
DACs_IN.DAC_3_4: IC27.V34(IO_L23N_T3U_N9_48)
DACs_IN.DAC_3_5: IC27.Y31(IO_L22P_T3U_N6_DBC_AD0P_48)
DACs_IN.DAC_3_6: IC27.Y32(IO_L22N_T3U_N7_DBC_AD0N_48)
DACs_IN.DAC_3_7: IC27.V33(IO_L21P_T3L_N4_AD8P_48)
DACs_IN.DAC_3_8: IC27.W34(IO_L21N_T3L_N5_AD8N_48)
DACs_IN.DAC_3_9: IC27.W30(IO_L20P_T3L_N2_AD1P_48)
DACs_IN.DAC_3_10: IC27.Y30(IO_L20N_T3L_N3_AD1N_48)
DACs_IN.DAC_3_11: IC27.W33(IO_L19P_T3L_N0_DBC_AD9P_48)
DACs_IN.DAC_3_12: IC27.Y33(IO_L19N_T3L_N1_DBC_AD9N_48)
DACs_IN.DAC_3_13: IC27.AC33(IO_L18P_T2U_N10_AD2P_48)
DACs_IN.DAC_3_14: IC27.AD33(IO_L18N_T2U_N11_AD2N_48)
DACs_IN.DAC_3_15: IC27.AA34(IO_L17P_T2U_N8_AD10P_48)
DACs_IN.DAC_4_0: IC27.AD34(IO_L15N_T2L_N5_AD11N_48)
DACs_IN.DAC_4_1: IC27.AB30(IO_L14P_T2L_N2_GC_48)
DACs_IN.DAC_4_2: IC27.AB31(IO_L14N_T2L_N3_GC_48)
DACs_IN.DAC_4_3: IC27.AA33(IO_T2U_N12_48)
DACs_IN.DAC_4_4: IC27.AA32(IO_L13P_T2L_N0_GC_QBC_48)
DACs_IN.DAC_4_5: IC27.AB32(IO_L13N_T2L_N1_GC_QBC_48)
DACs_IN.DAC_4_6: IC27.AC31(IO_L12P_T1U_N10_GC_48)
DACs_IN.DAC_4_7: IC27.AC32(IO_L12N_T1U_N11_GC_48)
DACs_IN.DAC_4_8: IC27.AE31(IO_T1U_N12_48)
DACs_IN.DAC_4_9: IC27.AD30(IO_L11P_T1U_N8_GC_48)
DACs_IN.DAC_4_10: IC27.AD31(IO_L11N_T1U_N9_GC_48)
DACs_IN.DAC_4_11: IC27.AE33(IO_L10P_T1U_N6_QBC_AD4P_48)
DACs_IN.DAC_4_12: IC27.AF34(IO_L10N_T1U_N7_QBC_AD4N_48)
DACs_IN.DAC_4_13: IC27.AE32(IO_L9P_T1L_N4_AD12P_48)
DACs_IN.DAC_4_14: IC27.AF32(IO_L9N_T1L_N5_AD12N_48)
DACs_IN.DAC_4_15: IC27.AF33(IO_L8P_T1L_N2_AD5P_48)
DACs_IN.DAC_5_0: IC27.AG34(IO_L8N_T1L_N3_AD5N_48)
DACs_IN.DAC_5_1: IC27.AG31(IO_L7P_T1L_N0_QBC_AD13P_48)
DACs_IN.DAC_5_2: IC27.AG32(IO_L7N_T1L_N1_QBC_AD13N_48)
DACs_IN.DAC_5_3: IC27.AF30(IO_L6P_T0U_N10_AD6P_48)
DACs_IN.DAC_5_4: IC27.AG30(IO_L6N_T0U_N11_AD6N_48)
DACs_IN.DAC_5_5: IC27.AD29(IO_L5P_T0U_N8_AD14P_48)
DACs_IN.DAC_5_6: IC27.AE30(IO_L5N_T0U_N9_AD14N_48)
DACs_IN.DAC_5_7: IC27.AF29(IO_L4P_T0U_N6_DBC_AD7P_48)
DACs_IN.DAC_5_8: IC27.AG29(IO_L4N_T0U_N7_DBC_AD7N_48)
DACs_IN.DAC_5_9: IC27.AC28(IO_L3P_T0L_N4_AD15P_48)
DACs_IN.DAC_5_10: IC27.AD28(IO_L3N_T0L_N5_AD15N_48)
DACs_IN.DAC_5_11: IC27.AE28(IO_L2P_T0L_N2_48)
DACs_IN.DAC_5_12: IC27.AF28(IO_L2N_T0L_N3_48)
DACs_IN.DAC_5_13: IC27.AC29(IO_T0U_N12_VRP_48)
DACs_IN.DAC_5_14: IC27.AE27(IO_L1P_T0L_N0_DBC_48)
DACs_IN.DAC_5_15: IC27.AF27(IO_L1N_T0L_N1_DBC_48)
DACs_IN.DAC_DATA_CLK_0: IC27.T23(IO_L17N_T2U_N9_AD10N_47)
DACs_IN.DAC_DATA_CLK_1: IC27.V22(IO_L16P_T2U_N6_QBC_AD3P_47)
DACs_IN.DAC_DATA_CLK_2: IC27.V23(IO_L16N_T2U_N7_QBC_AD3N_47)
DACs_IN.DAC_DATA_CLK_3: IC27.AB34(IO_L17N_T2U_N9_AD10N_48)
DACs_IN.DAC_DATA_CLK_4: IC27.AA29(IO_L16P_T2U_N6_QBC_AD3P_48)
DACs_IN.DAC_DATA_CLK_5: IC27.AB29(IO_L16N_T2U_N7_QBC_AD3N_48)
NetC700_1: IC27.AC34(IO_L15P_T2L_N4_AD11P_48) ; port DDMTD_OUT_CDR_CLK_SSTL18
NetC733_1: IC27.U21(IO_L15P_T2L_N4_AD11P_47) ; port DDMTD_OUT_MAIN_CLK_SSTL18

### Buses and harness runs
harness DACs_IN = port DACs_IN

### Notes on the sheet
- Bank 47 HP P1V8
- Bank 48 HP P1V8
- Copyright ISE WUT 2016.
- distributed WITHOUT ANY EXPRESS OR IMPLIED
- redistribute and modify this documentation under the
- terms of the CERN OHL v.1.2.
- licensed under the CERN OHL v.1.2. You may
- WARRANTY, INCLUDING OF
- (http://ohwr.org/CERNOHL). This documentation is
- This documentation describes Open Hardware and is
- AND FITNESS FOR A PARTICULAR PURPOSE.
- conditions.
- Please see the CERN OHL v.1.2 for applicable
- MERCHANTABILITY, SATISFACTORY QUALITY
- Project/Equipment
- Document
- Designer
- Drawn by
- Check.by
- File
- Last Mod.
- Print Date
- Sheet
- Size
- A3
- of
- Rev
- (in symbol XCKU040-1FFVA1156C, part D) BANK 47
- (in symbol XCKU040-1FFVA1156C, part E) BANK 48

### Library data of the parts
IC27 = XCKU040-1FFVA1156C: as IC27 on sheet FPGA_Bank_0_CFG; Manufacturer Part Number: XCKU040-1FFVA1156C; PackageDescription: BGA, 1.00mm Pitch, Square; 1156 Pin, 34 Columns X 34 Rows, Body 35.00mm X 35.00mm X 3.50mm H, IPC Medium Density; Part Number: XCKU040-1FFVA1156C; Component Kind: Standard; Component Type: Standard; Device: XCKU040-1FFVA1156C; Pin Count: 1156; Case: BGA1156; Mounted: Yes; Socket: No; SMD: Yes; Sense: No; ComponentHeight: 3.5mm; HelpURL: \\cern.ch\dfs\Applications\Altium\Datasheets\XCKU040-1FFVA1156C.pdf; ComponentLink1URL: \\cern.ch\dfs\Applications\Altium\Datasheets\XCKU040-1FFVA1156C_Package-Pinout.pdf; ComponentLink1Description: Package/Pinout; Author: CERN DEM CA; CreateDate: 16.08.2016; LatestRevisionDate: 16.08.2016